# EAGLE design Interface (EAGLE 7.6.0)
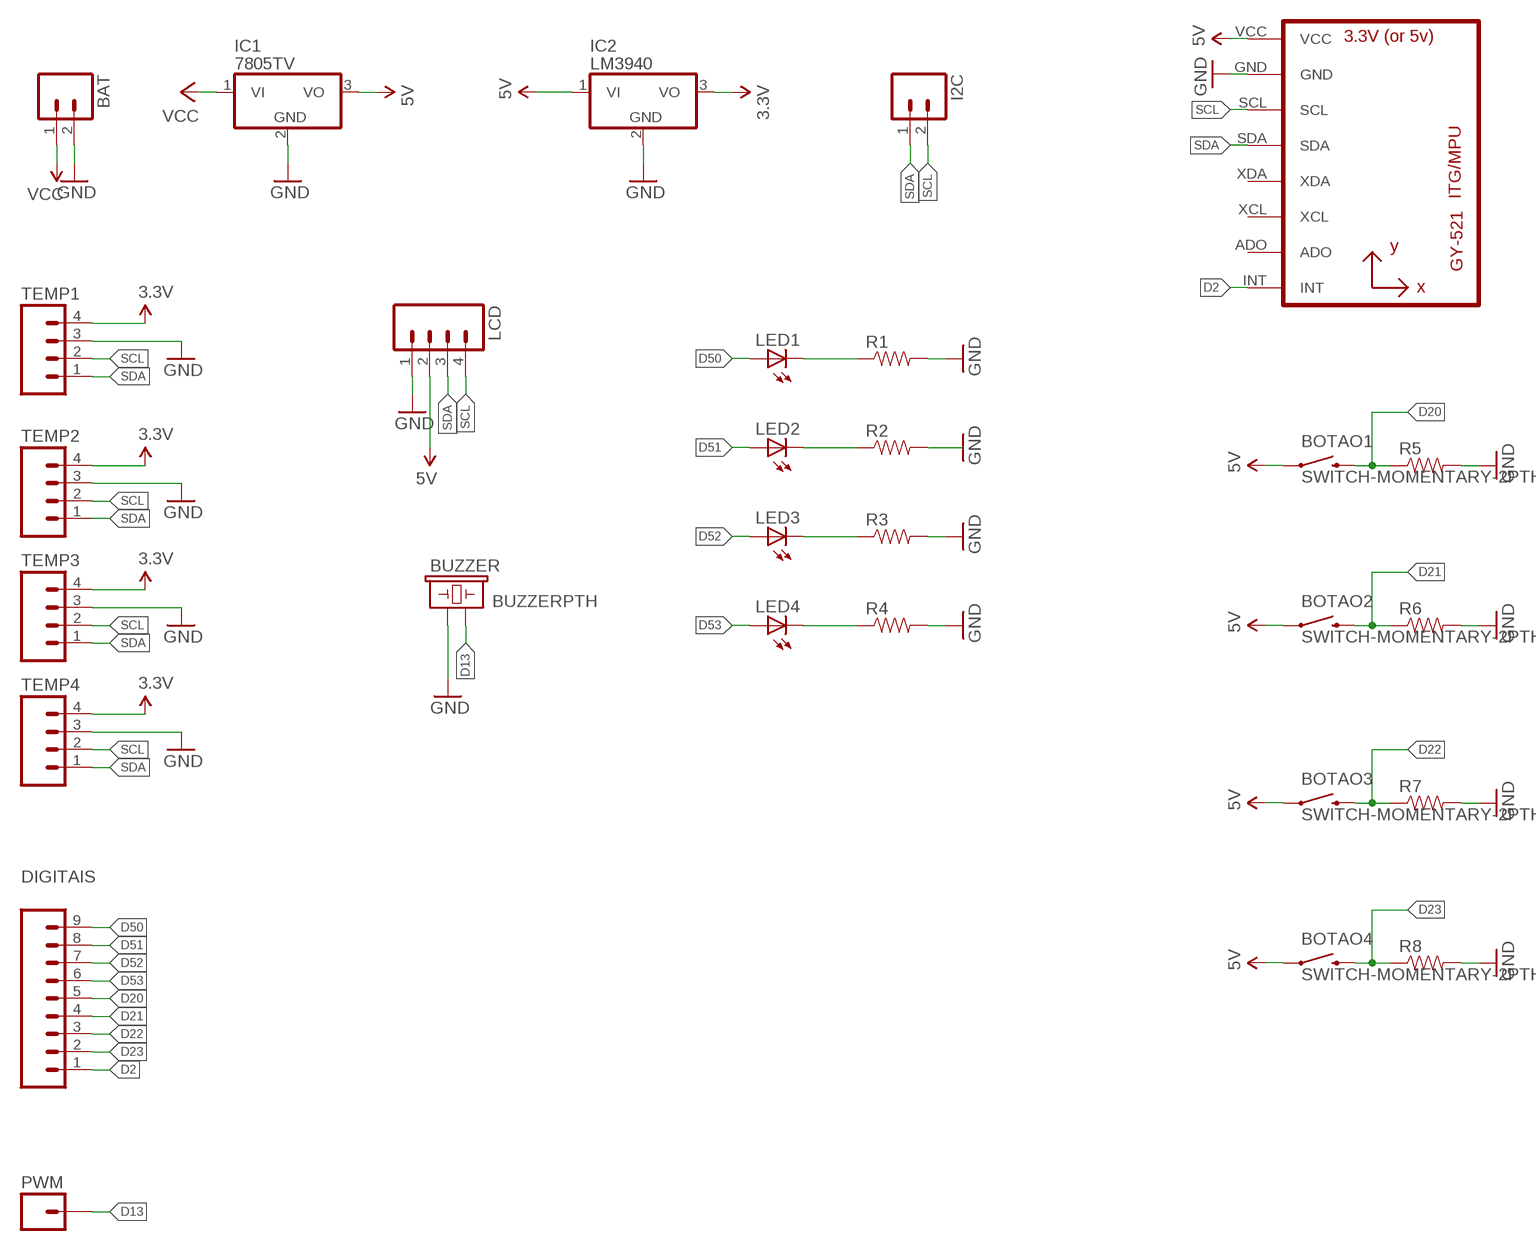
[diagram p0: schematic, sheet 1]

## Parts
BAT  M02PTH  [1X02]
BOTAO1  SWITCH-MOMENTARY-2PTH  [TACTILE-PTH]
BOTAO2  SWITCH-MOMENTARY-2PTH  [TACTILE-PTH]
BOTAO3  SWITCH-MOMENTARY-2PTH  [TACTILE-PTH]
BOTAO4  SWITCH-MOMENTARY-2PTH  [TACTILE-PTH]
BUZZER  BUZZERPTH  [BUZZER-12MM]
DIGITAIS  M09  [1X09]
I2C  M02PTH  [1X02]
IC1  7805TV  [TO220V]
IC2  LM3940  7805TV  [TO220V]
LCD  M04PTH  [1X04]
LED1  LED5MM  [LED5MM]
LED2  LED5MM  [LED5MM]
LED3  LED5MM  [LED5MM]
LED4  LED5MM  [LED5MM]
PWM  M01PTH  [1X01]
R1  RESISTOREZ  [AXIAL-0.3EZ]
R2  RESISTOREZ  [AXIAL-0.3EZ]
R3  RESISTOREZ  [AXIAL-0.3EZ]
R4  RESISTOREZ  [AXIAL-0.3EZ]
R5  RESISTOREZ  [AXIAL-0.3EZ]
R6  RESISTOREZ  [AXIAL-0.3EZ]
R7  RESISTOREZ  [AXIAL-0.3EZ]
R8  RESISTOREZ  [AXIAL-0.3EZ]
TEMP1  M04PTH  [1X04]
TEMP2  M04PTH  [1X04]
TEMP3  M04PTH  [1X04]
TEMP4  M04PTH  [1X04]
U1  GY-521MPU6050  [GY-521]

## Nets
3.3V: IC2.3(VO) TEMP1.4 TEMP2.4 TEMP3.4 TEMP4.4
5V: BOTAO1.1 BOTAO2.1 BOTAO3.1 BOTAO4.1 IC1.3(VO) IC2.1(VI) LCD.2 U1.VCC
D2: DIGITAIS.1 U1.INT
D13: BUZZER.- PWM.1
D20: BOTAO1.3 DIGITAIS.5 R5.P$1
D21: BOTAO2.3 DIGITAIS.4 R6.P$1
D22: BOTAO3.3 DIGITAIS.3 R7.P$1
D23: BOTAO4.3 DIGITAIS.2 R8.P$1
D50: DIGITAIS.9 LED1.A
D51: DIGITAIS.8 LED2.A
D52: DIGITAIS.7 LED3.A
D53: DIGITAIS.6 LED4.A
GND: BAT.2 BUZZER.+ IC1.2(GND) IC2.2(GND) LCD.1 R1.P$2 R2.P$2 R3.P$2 R4.P$2 R5.P$2 R6.P$2 R7.P$2 R8.P$2 TEMP1.3 TEMP2.3 TEMP3.3 TEMP4.3 U1.GND
N$1: LED3.K(C) R3.P$1
N$2: LED1.K(C) R1.P$1
N$4: LED2.K(C) R2.P$1
N$5: LED4.K(C) R4.P$1
SCL: I2C.2 LCD.4 TEMP1.2 TEMP2.2 TEMP3.2 TEMP4.2 U1.SCL
SDA: I2C.1 LCD.3 TEMP1.1 TEMP2.1 TEMP3.1 TEMP4.1 U1.SDA
VCC: BAT.1 IC1.1(VI)
Unconnected: U1.ADO U1.XCL U1.XDA

## Library data of the parts
BAT I2C = SparkFun-Connectors:M02: Standard 2-pin 0.1" header. Use with - straight break away headers ( PRT-00116) - right angle break away headers (PRT-00553) - swiss pins (PRT-00743) - machine pins (PRT-00117) - female headers (PRT-00115) Molex polarized connector foot print use with: PRT-08233 with associated crimp pins and housings. 2.54_SCREWTERM for use with PRT-10571. 3.5mm Screw Terminal footprints for PRT-08084 5mm Screw Terminal footprints for use with PRT-08432
BOTAO1-BOTAO4 = SparkFun-Electromechanical:SWITCH-MOMENTARY-2: Various NO switches- pushbuttons, reed, etc; PROD_ID: SWCH-08441
BUZZER = SparkFun-Electromechanical:BUZZER: Buzzer 12mm Spark Fun Electronics SKU : Comp-Buzzer
DIGITAIS = SparkFun-Connectors:M09: Header 9 Standard 9-pin 0.1" header. Use with straight break away headers (SKU : PRT-00116), right angle break away headers (PRT-00553), swiss pins (PRT-00743), machine pins (PRT-00117), and female headers (PRT-00115).
IC1 IC2 = linear:78*: Positive VOLTAGE REGULATOR Source: http://cache.national.com/ds/LM/LM78L05.pdf http://www.fairchildsemi.com/ds/LM/LM7805.pdf
LCD TEMP1-TEMP4 = SparkFun-Connectors:M04: Header 4 Standard 4-pin 0.1" header. Use with straight break away headers (SKU : PRT-00116), right angle break away headers (PRT-00553), swiss pins (PRT-00743), machine pins (PRT-00117), and female headers (PRT-00115). Molex polarized connector foot print use with SKU : PRT-08231 with associated crimp pins and housings. 1MM SMD Version SKU: PRT-10208; PROD_ID: CONN-09696
LED1-LED4 = led:LED: LED OSRAM: - CHIPLED LG R971, LG N971, LY N971, LG Q971, LY Q971, LO R971, LY R971 LH N974, LH R974 LS Q976, LO Q976, LY Q976 LO Q996 - Hyper CHIPLED LW Q18S LB Q993, LB Q99A, LB R99A - SideLED LS A670, LO A670, LY A670, LG A670, LP A670 LB A673, LV A673, LT A673, LW A673 LH A674 LY A675 LS A676, LA A676, LO A676, LY A676, LW A676 LS A679, LY A679, LG A679 - Hyper Micro SIDELED® LS Y876, LA Y876, LO Y876, LY Y876 LT Y87S - SmartLED LW L88C, LW L88S LB L89C, LB L89S, LG L890 LS L89K, LO L89K, LY L89K LS L896, LA L896, LO L896, LY L896 - TOPLED LS T670, LO T670, LY T670, LG T670, LP T670 LSG T670, LSP T670, LSY T670, LOP T670, LYG T670 LG T671, LOG T671, LSG T671 LB T673, LV T673, LT T673, LW T673 LH T674 LS T676, LA T676, LO T676, LY T676, LB T676, LH T676, LSB T676, LW T676 LB T67C, LV T67C, LT T67C, LS T67K, LO T67K, LY T67K, LW E67C LS E67B, LA E67B, LO E67B, LY E67B, LB E67C, LV E67C, LT E67C LW T67C LS T679, LY T679, LG T679 LS T770, LO T770, LY T770, LG T770, LP T770 LB T773, LV T773, LT T773, LW T773 LH T774 LS E675, LA E675, LY E675, LS T675 LS T776, LA T776, LO T776, LY T776, LB T776 LHGB T686 LT T68C, LB T68C - Hyper Mini TOPLED® LB M676 - Mini TOPLED Santana® LG M470 LS M47K, LO M47K, LY M47K Source: http://www.osram.convergy.de LUXEON: - LUMILED® LXK2-PW12-R00, LXK2-PW12-S00, LXK2-PW14-U00, LXK2-PW14-V00 LXK2-PM12-R00, LXK2-PM12-S00, LXK2-PM14-U00 LXK2-PE12-Q00, LXK2-PE12-R00, LXK2-PE12-S00, LXK2-PE14-T00, LXK2-PE14-U00 LXK2-PB12-K00, LXK2-PB12-L00, LXK2-PB12-M00, LXK2-PB14-N00, LXK2-PB14-P00, LXK2-PB14-Q00 LXK2-PR12-L00, LXK2-PR12-M00, LXK2-PR14-Q00, LXK2-PR14-R00 LXK2-PD12-Q00, LXK2-PD12-R00, LXK2-PD12-S00 LXK2-PH12-R00, LXK2-PH12-S00 LXK2-PL12-P00, LXK2-PL12-Q00, LXK2-PL12-R00 Source: www.luxeon.com KINGBRIGHT: KA-3528ASYC Source: www.kingbright.com
PWM = SparkFun-Connectors:M01: Header 1 Standard 1-pin 0.1" header. Use with straight break away headers (SKU : PRT-00116), right angle break away headers (PRT-00553), swiss pins (PRT-00743), machine pins (PRT-00117), and female headers (PRT-00115). SMTSO-256-ET is a "flush mount" nut for a 4-40 screw. The older package used to be too tight, and did not allow it to sit properly thru the drill hit. The latest (0.165DIA) fits nice and snug.
R1-R8 = SparkFun-Passives:RESISTOR: Resistor Basic schematic elements and footprints for 0603, 1206, and PTH resistors.
U1 = gy-521:GY-521

## Board
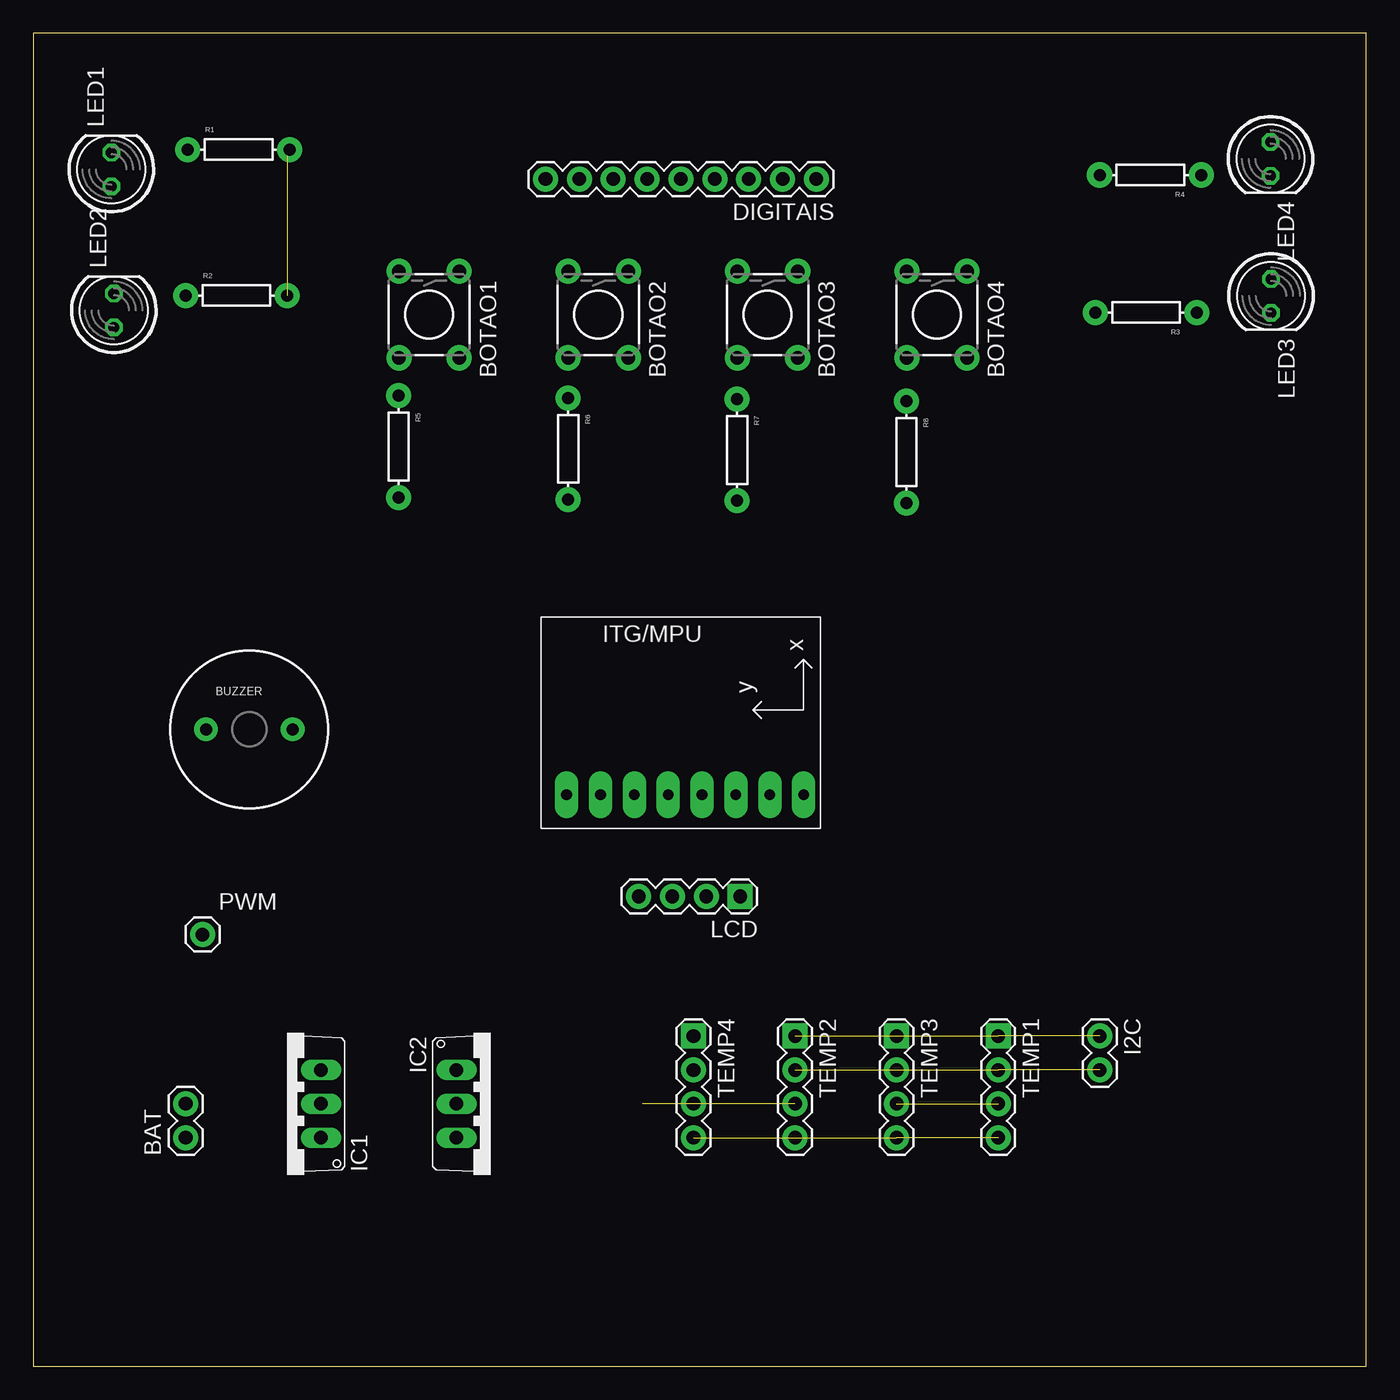
[diagram p1: board, top side]
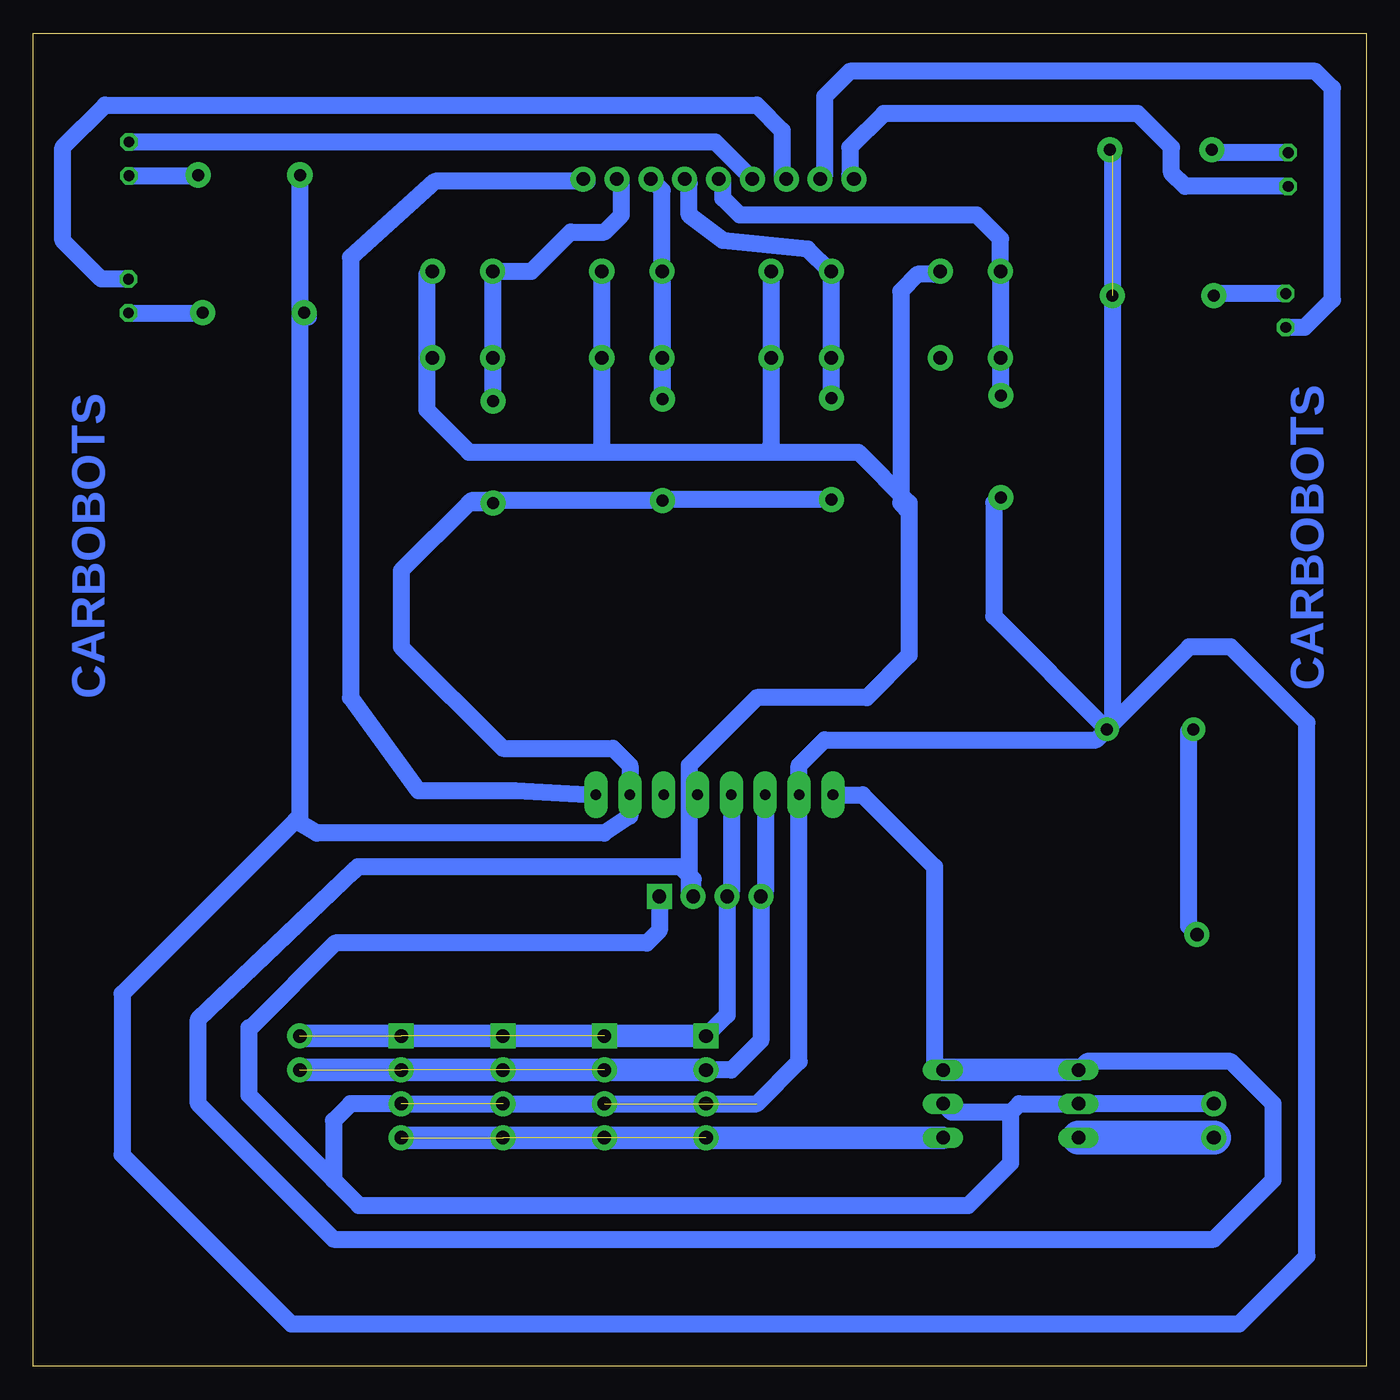
[diagram p2: board, bottom side, seen from below]

Size 100 x 100 mm. Coordinates in mm from the lower left corner, seen from the top.
Outline: 0,0 100,0 100,100 0,100 0,0
Copper layers (1*16): Top 0.035mm / dielectric 1.5mm / Bottom 0.035mm
Design rules "default": minimum track width 10mil, minimum drill 24mil, track to track 8mil, track to pad 8mil, pad to pad 8mil, via to via 8mil, smd to smd 8mil, copper to edge 40mil, drill to drill 8mil, minimum pad ring 10mil, minimum via ring 8mil, stop-mask expansion 4mil, vias tented up to drill 0mil, thermal gap 10mil

### Footprints (pad centres in the part's own frame; a part is rotated, then mirrored left to right if it is on the bottom)
1X02 = drill 1.016 pad 1.88: 1 0,0; 2 2.54,0
TACTILE-PTH = drill 1.016 pad 1.88: 1 -3.251,2.261; 2 3.251,2.261; 3 -3.251,-2.261; 4 3.251,-2.261
BUZZER-12MM = drill 0.9 pad 1.778: + 3.25,0; - -3.25,0
1X09 = drill 1.016 pad 1.88: 1 0,0; 2 2.54,0; 3 5.08,0; 4 7.62,0; 5 10.16,0; 6 12.7,0; 7 15.24,0; 8 17.78,0; 9 20.32,0
TO220V = drill 1.016 long: 1 -2.54,-2.54; 2 0,-2.54; 3 2.54,-2.54
1X04 = drill 1.016 pad 1.88 square: 1 0,0 | drill 1.016 pad 1.88: 2 2.54,0; 3 5.08,0; 4 7.62,0
LED5MM = drill 0.813 octagon: A -1.27,0; K 1.27,0
1X01 = drill 1.016 pad 1.88: 1 0,0
AXIAL-0.3EZ = drill 0.9 pad 1.88: P$1 -3.81,0; P$2 3.81,0
GY-521 = drill 0.8 pad 1.778 long: ADO -8.89,-6.35; GND -8.89,6.35; INT -8.89,-8.89; SCL -8.89,3.81; SDA -8.89,1.27; VCC -8.89,8.89; XCL -8.89,-3.81; XDA -8.89,-1.27

### Placement (x,y rotation side)
BAT  11.43,17.14 90 top
BOTAO1  29.69,78.9 270 top
BOTAO2  42.39,78.9 270 top
BOTAO3  55.09,78.9 270 top
BOTAO4  67.79,78.9 270 top
BUZZER  16.21,47.78 0 top
DIGITAIS  58.75,89.06 180 top
I2C  80.01,24.77 270 top
IC1  19.05,19.68 90 top
IC2  34.29,19.68 270 top
LCD  53.03,35.24 180 top
LED1  5.85,89.78 90 top
LED2  6.04,79.21 90 top
LED3  92.86,80.29 270 top
LED4  92.82,90.58 270 top
PWM  12.7,32.38 0 top
R1  15.4,91.28 0 top
R2  15.24,80.33 0 top
R3  83.5,79.06 180 top
R4  83.81,89.38 180 top
R5  27.4,68.99 270 top
R6  40.13,68.83 270 top
R7  52.8,68.74 270 top
R8  65.5,68.58 270 top
TEMP1  72.39,24.77 270 top
TEMP2  57.15,24.77 270 top
TEMP3  64.77,24.77 270 top
TEMP4  49.53,24.77 270 top
U1  48.9,51.76 90 top

### Tracks (layer width: path | path; a pad name or v marks a point on that pad's centre or on a via)
3.3V  (3 unrouted)
  Bottom 1.676: IC2.3 TEMP1.4
5V
  Bottom 1.27: U1.VCC 37.79,42.87 32.38,37.47 32.38,22.86 IC2.1 | IC1.3 20.95,22.86 10.16,22.86 6.99,19.68 6.99,13.97 11.43,9.53 77.47,9.53 87.63,19.68 87.63,26.04 75.93,37.18 75.64,37.47 51.44,37.47 50.49,36.52 LCD.2 50.8,35.55 50.8,45.09 45.72,50.16 37.47,50.16 34.29,53.34 34.29,64.14 | BOTAO4.1 70.25,82.15 70.48,81.92 70.48,71.75 67.31,68.58 57.15,68.58 | 57.15,68.58 45.09,68.58 | 45.09,68.58 38.1,68.58 34.29,64.77 34.29,64.14 | BOTAO3.1 57.35,68.78 57.15,68.58 | BOTAO2.1 44.65,69.01 45.09,68.58 | BOTAO1.1 32.15,82.15 32.38,81.92 33.66,81.92 34.92,80.64 34.92,64.77 34.29,64.14
  Bottom 1.676: IC1.3 IC2.1
D2
  Bottom 1.27: DIGITAIS.1 58.58,89.06 58.42,88.9 69.85,88.9 76.2,83.19 76.2,50.16 71.12,43.18 63.83,43.18 U1.INT
D13
  Bottom 1.27: BUZZER.- 13.18,47.78 13.34,47.62 13.34,33.02 PWM.1
D20
  Bottom 1.27: DIGITAIS.5 48.26,88.73 48.26,87.63 46.99,86.36 29.21,86.36 27.43,84.58 BOTAO1.3 27.43,72.83 R5.P$1
D21
  Bottom 1.27: DIGITAIS.4 50.8,88.73 50.8,86.36 48.26,84.45 41.91,83.82 40.24,82.15 BOTAO2.3 R6.P$1
D22
  Bottom 1.27: DIGITAIS.3 52.83,88.22 BOTAO3.3 52.8,82.13 R7.P$1
D23
  Bottom 1.27: DIGITAIS.2 55.88,88.73 55.88,86.36 57.15,85.09 59.69,85.09 62.63,82.15 BOTAO4.3 65.5,82.13 R8.P$1
D50
  Bottom 1.27: LED1.A 13.58,88.51 14.61,89.53 14.61,91.44 17.14,93.98 36.2,93.98 38.73,91.44 38.73,89.36 DIGITAIS.9
D51
  Bottom 1.27: LED2.A 4.61,77.94 2.54,80.01 2.54,95.89 3.81,97.16 38.73,97.16 40.64,95.25 40.64,89.39 DIGITAIS.8
D52
  Bottom 1.27: LED3.A 94.9,81.56 97.79,84.45 97.79,91.44 94.61,94.61 45.72,94.61 43.81,92.71 43.81,89.36 DIGITAIS.7
D53
  Bottom 1.27: LED4.A 48.84,91.85 DIGITAIS.6
GND  (4 unrouted)
  Bottom 1.27: 77.47,13.97 83.82,20.32 83.82,25.4 83.58,25.51 77.34,31.75 53.98,31.75 53.03,32.7 LCD.1 | 77.47,13.97 75.56,12.06 29.84,12.06 26.67,15.24 26.67,19.05 | 26.67,19.05 26.04,19.68 IC1.2 BAT.2 | 26.67,19.05 31.11,19.05 IC2.2 | BUZZER.+ 20.25,46.99 40.64,46.99 42.55,45.09 42.55,43.18 42.55,43.17 U1.GND 42.55,22.86 45.72,19.68 TEMP1.3 76.2,19.68 77.47,18.41 77.47,13.97 | R1.P$2 19.21,90.97 19.05,90.81 19.05,48.2 BUZZER.+ | R4.P$2 80,88.91 80.01,88.9 80.01,79.38 R3.P$2 79.38,78.74 80.01,78.74 80.01,41.27 80.33,40.96 | 80.33,40.96 93.34,27.94 93.34,15.88 80.64,3.17 9.53,3.17 4.45,8.26 4.45,48.26 10.16,53.98 13.27,53.98 BUZZER.+ | R8.P$2 67.31,64.77 | 67.31,64.77 72.39,59.69 72.39,53.98 64.77,46.35 56.52,46.35 55.24,45.09 55.24,41.27 57.15,40.01 78.74,40.01 80.33,40.96 | 67.31,64.77 67.15,64.93 R7.P$2 52.71,65.02 R6.P$2 | R5.P$2 27.53,65.18 27.94,64.77 27.94,56.27 BUZZER.+
N$1
  Bottom 1.27: LED3.K 87.34,79.02 R3.P$1
N$2
  Bottom 1.27: LED1.K 11.36,91.05 R1.P$1
N$4
  Bottom 1.27: LED2.K 11.29,80.48 R2.P$1
N$5
  Bottom 1.27: LED4.K 87.68,89.31 R4.P$1
SCL  (3 unrouted)
  Bottom 1.27: U1.SCL 45.09,42.55 45.09,35.57 LCD.4 45.41,24.44 47.62,22.23 TEMP4.2
  Bottom 1.676: I2C.2 TEMP4.2
SDA  (3 unrouted)
  Bottom 1.27: U1.SDA 47.63,35.56 LCD.3 47.95,26.34 TEMP4.1
  Bottom 1.676: I2C.1 TEMP4.1
VCC
  Bottom 2.54: BAT.1 IC1.1

### Text on the board
Bottom: CARBOBOTS | CARBOBOTS